# EAGLE schematic Redox1.1 Integration Trial (EAGLE 9.6.2)
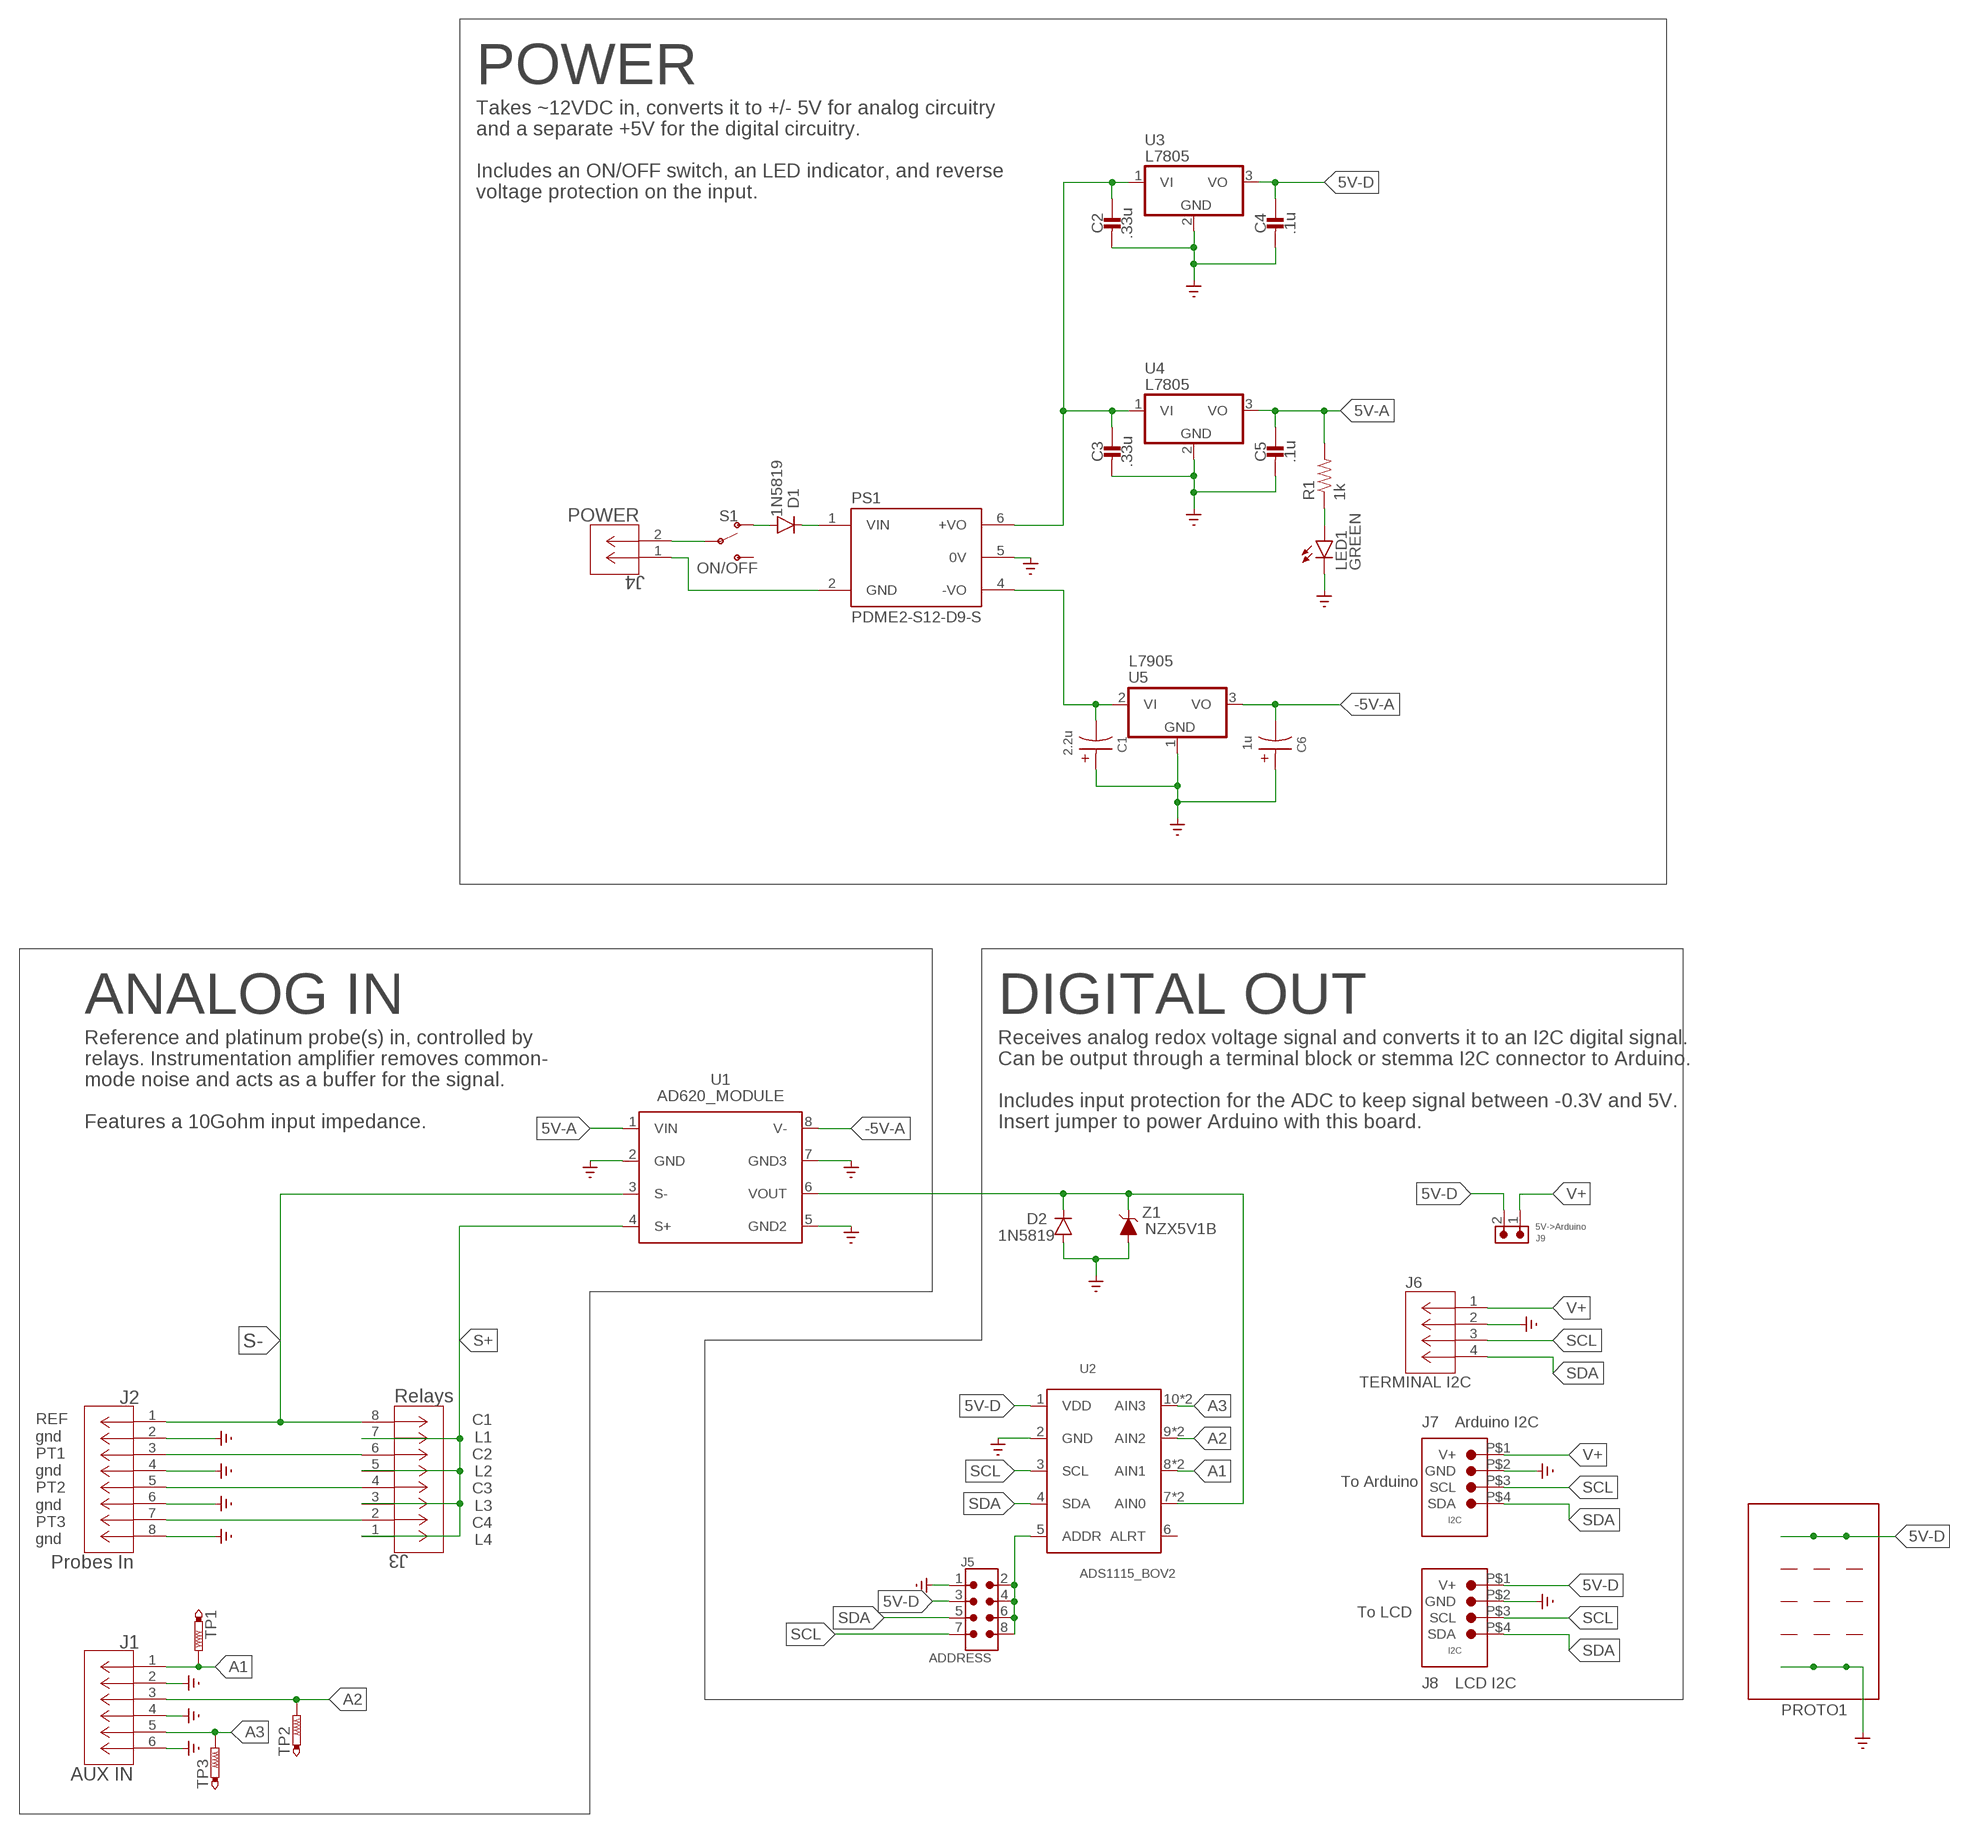
[diagram p0: schematic, sheet 1]

## Parts
C1  2.2u  CAP_POLAR_TH5MM  [E2,5-5]
C2  .33u  CAP-TH-CERAMIC  [THCAPCERAMIC]
C3  .33u  CAP-TH-CERAMIC  [THCAPCERAMIC]
C4  .1u  CAP-TH-CERAMIC  [THCAPCERAMIC]
C5  .1u  CAP-TH-CERAMIC  [THCAPCERAMIC]
C6  1u  CAP_POLAR_TH5MM  [E2,5-5]
D1  1N5819  DIODE-TH  [DIODE-TH]
D2  1N5819  DIODE-TH  [DIODE-TH]
J1  AUX IN  6PIN_TERMINAL_5MM  [6PIN_TERMINAL_5MM]
J2  Probes In  8PIN_TERMINAL_5MM  [8PIN_TERMINAL_5MM]
J3  Relays  8PIN_TERMINAL_5MM  [8PIN_TERMINAL_5MM]
J4  POWER  2PIN_TERMINAL_5MM  [CONN2_710002_WRE]
J5  ADDRESS  6130XX21121_61300821121  [61300821121]
J6  TERMINAL I2C  4PIN_TERMINAL_5MM  [4PIN_TERMINAL_5MM]
J7  Arduino I2C  JST_PH_4PIN_STEMMA  [JST_PH_4PIN]
J8  LCD I2C  JST_PH_4PIN_STEMMA  [JST_PH_4PIN]
J9  5V->Arduino  1X2MALEPIN  [61300211121]
LED1  GREEN  LED-TH(5MM)  [LED-5MM-TH]
PROTO1  PROTO_AREA_5X3  [PROTO_AREA_5X3]
PS1  PDME2-S12-D9-S  [CONV_PDME2-S12-D9-S]
R1  1k  RESISTOR-TH  [THRESISTOR]
S1  ON/OFF  SPDT_TT11_TH  [TT11_SPDT]
TP1  PTR1PAD1-13  [P1-13]
TP2  PTR1PAD1-13  [P1-13]
TP3  PTR1PAD1-13  [P1-13]
U1  AD620_MODULE  [AD620_MODULE]
U2  ADS1115_BOV2  [ADS1115_V2]
U3  L7805  7805TV  [TO220V]
U4  L7805  7805TV  [TO220V]
U5  L7905  L79REGULATORTO220V  [TO220V]
Z1  NZX5V1B  ZENER  [DIODE-TH]

## Nets
5V-A: C5.C1 R1.R2 U1.1(VIN) U4.3(VO)
5V-D: C4.C1 J5.3 J8.P$1(V+) J9.2 PROTO1.1 PROTO1.2 PROTO1.3 U2.1(VDD) U3.3(VO)
-5V-A: C6.- U1.8(V-) U5.3(VO)
A1: J1.1 TP1.TP U2.8(AIN1) U2.A1(AIN1)
A2: J1.3 TP2.TP U2.9(AIN2) U2.A2(AIN2)
A3: J1.5 TP3.TP U2.10(AIN3) U2.A3(AIN3)
GND: C1.+ C2.C2 C3.C2 C4.C2 C5.C2 C6.+ D2.P$1(A) J1.2 J1.4 J1.6 J2.2 J2.4 J2.6 J2.8 J5.1 J6.2 J7.P$2(GND) J8.P$2(GND) LED1.K(C) PROTO1.13 PROTO1.14 PROTO1.15 PS1.5(0V) U1.2(GND) U1.5(GND2) U1.7(GND3) U2.2(GND) U3.2(GND) U4.2(GND) U5.1(GND) Z1.P$1(A) ; supply symbol labelled SUPPLY0_GND_
N$1: D2.P$2(C) U1.6(VOUT) U2.7(AIN0) U2.A0(AIN0) Z1.P$2(C)
N$2: C1.- PS1.4(-VO) U5.2(VI)
N$3: D1.P$2(C) PS1.1(VIN)
N$4: J4.1 PS1.2(GND)
N$7: C2.C1 C3.C1 PS1.6(+VO) U3.1(VI) U4.1(VI)
N$8: J4.2 S1.P$2(C)
N$9: LED1.A R1.R1
N$10: D1.P$1(A) S1.P$1
N$11: J2.3 J3.6
N$12: J2.5 J3.4
N$13: J5.2 J5.4 J5.6 J5.8 U2.5(ADDR)
N$14: J2.7 J3.2
S+: J3.1 J3.3 J3.5 J3.7 U1.4(S+)
S-: J2.1 J3.8 U1.3(S-)
SCL: J5.7 J6.3 J7.P$3(SCL) J8.P$3(SCL) U2.3(SCL)
SDA: J5.5 J6.4 J7.P$4(SDA) J8.P$4(SDA) U2.4(SDA)
V+: J6.1 J7.P$1(V+) J9.1
Unconnected: PROTO1.4 PROTO1.5 PROTO1.6 PROTO1.7 PROTO1.8 PROTO1.9 PROTO1.10 PROTO1.11 PROTO1.12 S1.P$3 U2.6(ALRT)

## Notes on the sheet
- POWER
- Takes ~12VDC in, converts it to +/- 5V for analog circuitry 
  and a separate +5V for the digital circuitry. 
  
  Includes an ON/OFF switch, an LED indicator, and reverse 
  voltage protection on the input.
- ANALOG IN | DIGITAL OUT
- Reference and platinum probe(s) in, controlled by 
  relays. Instrumentation amplifier removes common-
  mode noise and acts as a buffer for the signal.
  
  Features a 10Gohm input impedance.
- Receives analog redox voltage signal and converts it to an I2C digital signal.
  Can be output through a terminal block or stemma I2C connector to Arduino.
  
  Includes input protection for the ADC to keep signal between -0.3V and 5V.
  Insert jumper to power Arduino with this board.
- C1
  L1
  C2
  L2
  C3
  L3
  C4
  L4
- To Arduino
- REF
  gnd
  PT1
  gnd
  PT2
  gnd
  PT3
  gnd
- To LCD

## Library data of the parts
C1 C6 = !Redox:CAP_POLAR_TH: Elecrolytic Cap, TH
C2-C5 = !Redox:CAP-TH-CERAMIC: Capacitor through-hole ceramic
D1 D2 = !Redox:DIODE-TH: Diode through-hole
J1 = !Redox:6PIN_TERMINAL_5MM: 6 Pin Screw Terminal Block, 5mm pitch
J2 J3 = !Redox:8PIN_TERMINAL_5MM: 8 Pin Screw Terminal Block, 5mm pitch
J4 = !Redox:2PIN_TERMINAL_5MM; COPYRIGHT: Copyright (C) 2023 Ultra Librarian. All rights reserved.; MANUFACTURER_PART_NUMBER: 691137710002; MFR_NAME: Wurth Electronics
J5 = Wurth_Connectors_WR-PHD:6130XX21121_61300821121: WR-PHD 2.54 mm THT Dual Pin Header ARTICLE PROPERTIES: Pins:4;​ 6;​ 8;​ 10;​ 12;​ 14;​ 16;​ 18;​ 20;​ 22;​ 24;​ 26;​ 28;​ 30;​ 32;​ 34;​ 36;​ 40;​ 44;​ 64;​ 72;​ 80 KIND PROPERTIES: Pitch：2.54 mm Quality Class:3 as per CECC 75 301-802 Rows：Dual Gender：Pin Header Type：Board Stacker MATERIAL PROPERTIES: Insulator Material :PA6T Insulator Flammability Rating:UL94 V-0 Contact Material:Copper Alloy Contact Plating:Gold Contact Type:Stamped GENERAL INFORMATION Operating Temperature:-40 up to +105 °C Compliance:Lead free / RoHS ELECTRICAL PROPERTIES: Rated Current:3 A IR 1:3 A Withstanding Voltage:500 V (AC) Contact Resistance:20 mΩ RISO:1000 MΩ CERTIFICATION UL Approval:E323964 PACKAGING PROPERTIES Packaging:Bag <https://katalog.we-online.com/media/images/v2/o33215v209%20Family_WR-PHD_6130xx21121.jpg> Details see: https://katalog.we-online.com/en/em/PHD_2_54_THT_DUAL_PIN_HEADER_6130XX21121 Updated by Yingchun,Shan 2019-10-16 2019 (C) Würth Elektronik; DATASHEET-URL: https://www.we-online.com/catalog/datasheet/61300821121.pdf; GENDER: Pin Header; IR: 3A; MOUNT: THT; PACKAGING: Bag; PART-NUMBER: 61300821121; PINS: 8; PITCH: 2.54mm; ROWS: Dual; TYPE: Board Stacker; VALUE: 61300821121
J6 = !Redox:4PIN_TERMINAL_5MM: 4 Pin Terminal Block, 5mm pitch
J7 J8 = !Redox:JST_PH_4PIN_STEMMA: STEMMA 4 pin connector for I2C communication V+ GND SCL DSA
J9 = !Redox:1X2MALEPIN: 1x2 pin header 2.54mm pitch
LED1 = !Redox:LED-TH(5MM): LED 5mm through hole
PROTO1 = !Redox:PROTO_AREA_5X3: 5x3 Prototyping Area
PS1 = PDME2-S12-D9-S:PDME2-S12-D9-S; MANUFACTURER: CUI Inc; MAXIMUM_PACKAGE_HEIGHT: 10.41 mm; PARTREV: 1.0; STANDARD: Manufacturer Recommendations
R1 = !Redox:RESISTOR-TH: Through-hole Resistor
S1 = !Redox:SPDT_TT11_TH: TT11 DPST toggle switch, Through-Hole
TP1-TP3 = testpad:PTR1: TEST PIN
U1 = !Redox:AD620_MODULE: AD620 Instumentation Amplifier Module (breakout board)
U2 = !Redox:ADS1115_BO: ADS1115 breakout board. 16-bit ADC, 1x10 through hole (pin header)
U3 U4 = !Redox:78*: Positive VOLTAGE REGULATOR Source: http://cache.national.com/ds/LM/LM78L05.pdf http://www.fairchildsemi.com/ds/LM/LM7805.pdf
U5 = !Redox:L79*REGULATOR: Negative VOLTAGE REGULATOR
Z1 = !Redox:ZENER: Zener Diode, Through-Hole